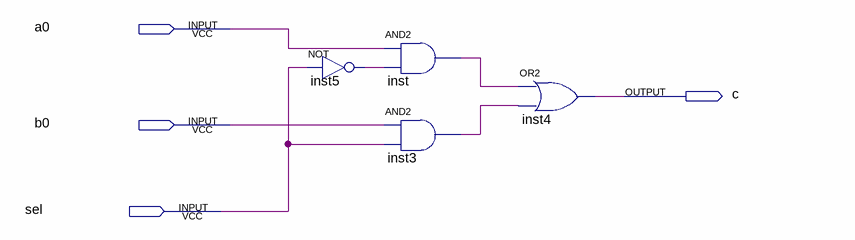
[diagram p0: schematic sheet]
// Quartus schematic mux1.bdf as structural Verilog: 4 symbols, 4 pins
module mux1 (
  input  a0,
  input  b0,
  input  sel,
  output c
);

  wire inst3_out, inst5_out, inst_out;

  not inst5 (inst5_out, sel);
  and inst (inst_out, a0, inst5_out);
  and inst3 (inst3_out, b0, sel);
  or inst4 (c, inst_out, inst3_out);
endmodule
